# EasyEDA Pro project my_foc.eprj

# Schematic Schematic1
Create Date: 2023-12-03; Page Name: P1; Project Name: my_foc; Schematic Name: Schematic1; Update Date: 2023-12-04; Drawed: LaLin; Page Size: A3; Version: V1.0
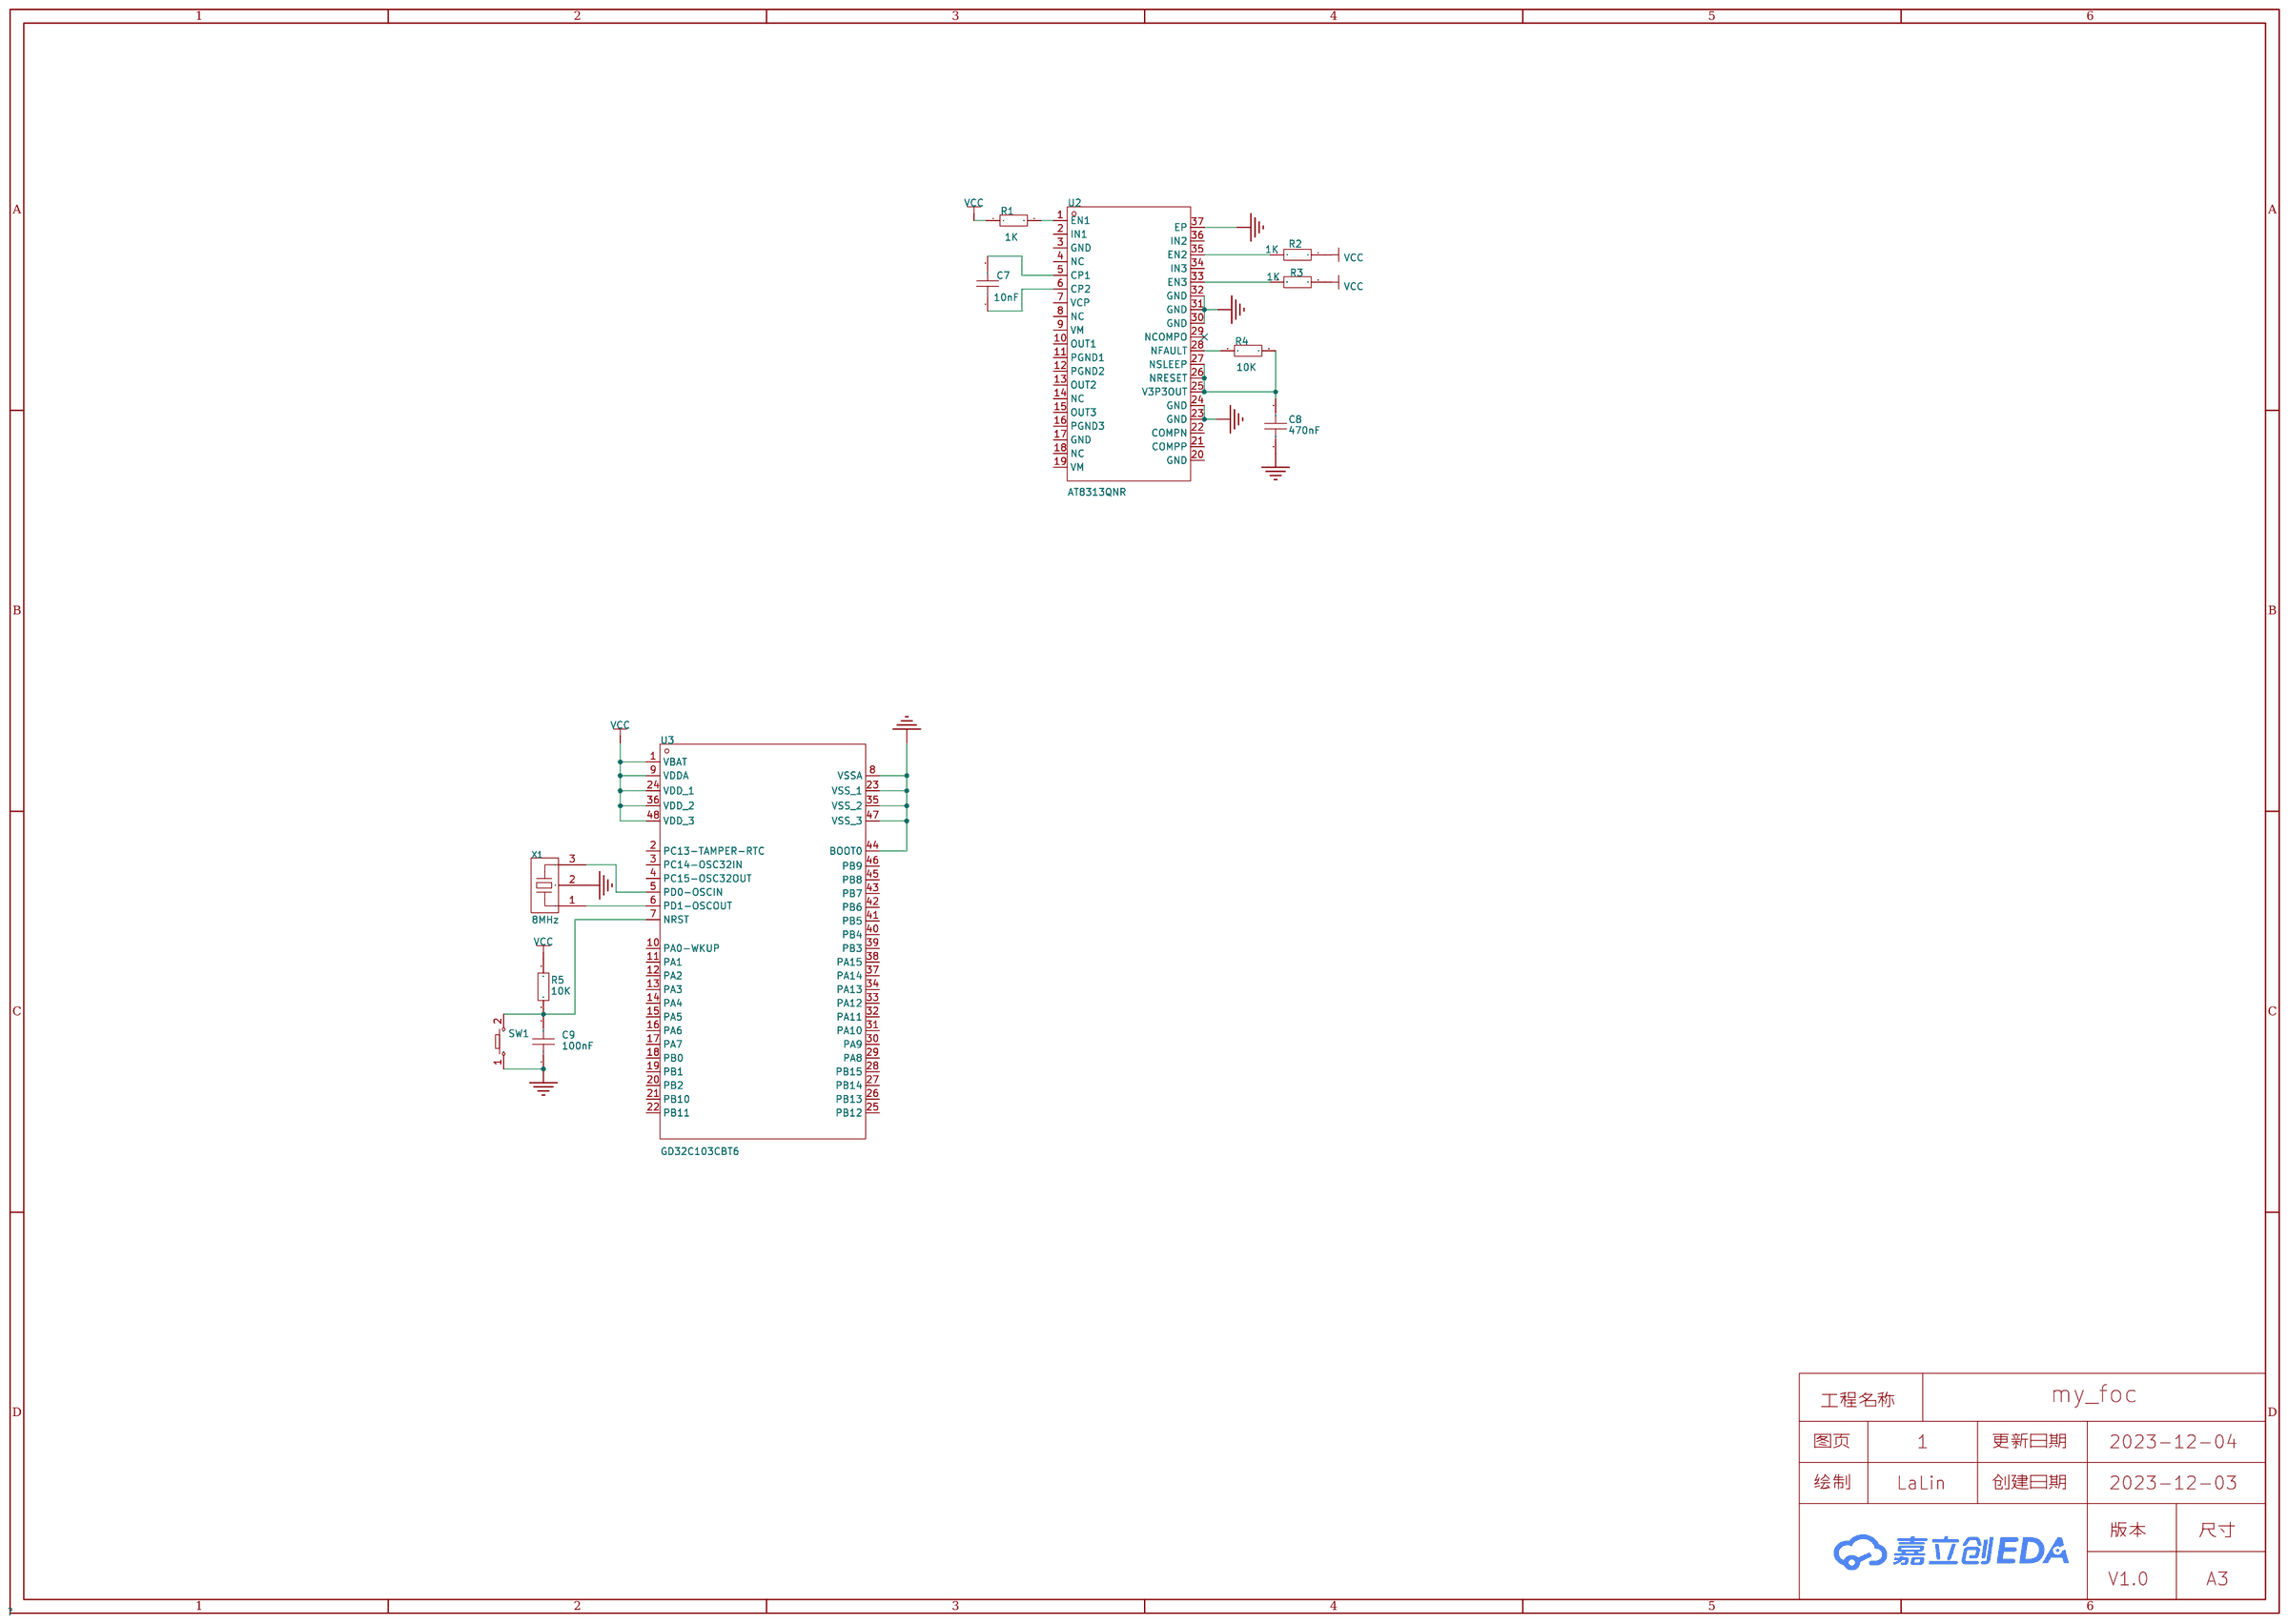
[diagram p0: schematic sheet]

## Parts
C7  10nF  [C0603]
C8  470nF  [C0603]
C9  100nF  [C0603]
R1  1K  [R0603]
R2  1K  [R0603]
R3  1K  [R0603]
R4  10K  [R0603]
R5  10K  [R0603]
SW1  -  [Key_SMD_3x4x2]
U2  AT8313QNR  [QFN-36_L6.0-W6.0-P0.50-TL-EP4.1]
U3  GD32C103CBT6  [LQFP-48_L7.0-W7.0-P0.50-LS9.0-BL]
X1  8MHz  [OSC-SMD_3P-L3.2-W1.3-P1.2-L]

## Library data of the parts
C7-C9 = CAP_0603: Supplier Footprint: 0603
R1-R5 = Res_0603: Supplier Footprint: 0603
SW1 = Key_SMD_3x4x2: Supplier Footprint: SMD
U2 = AT8313QNR: Supplier Part: C5296869; Manufacturer: 杭州中科微; Supplier Footprint: QFN-36; JLCPCB Part Class: 扩展库; Datasheet: https://atta.szlcsc.com/upload/public/pdf/source/20221201/3C14148FDFCD8998E6B5A1E4B6857CE3.pdf; Supplier: LCSC
U3 = GD32C103CBT6: CPU内核:ARM Cortex-M4;CPU最大主频:120MHz;程序存储容量:128KB;程序存储器类型:FLASH;GPIO端口数量:37;工作电压范围:-;RAM总容量:32KB;; LCSC Part Name: GD32C103CBT6 带CAN功能; Supplier Part: C2885643; Manufacturer: GigaDevice(兆易创新); Supplier Footprint: LQFP-48(7x7); JLCPCB Part Class: 扩展库; Datasheet: https://atta.szlcsc.com/upload/public/pdf/source/20210825/C2885643_F7BB04929325AB1735698A5112B59DA1.pdf; Supplier: LCSC; CPU Core: ARM Cortex-M4; CPU Maximum Speed: 120MHz; Program Storage Size: 128KB; Program Memory Type: FLASH; GPIO Ports Number: 37; RAM Size: 32KB; ADC (Bit): 12bit; DAC (Bit): 12bit; 16Bit Timer: 13; CAN: 2; UART/USART: 3; I2C: 2; I2S: 2; SPI: 3; Universal Serial Bus: 有; Peripheral/Function: 看门狗；RTC实时时钟; Watchdog: 有; Real-Time Clock: 有; Internal Oscillator: 有
X1 = CSTCE8M00G52-R0: 频率:8MHz;频率容差:±0.5%;内置负载电容:10pF;谐振阻抗:40Ω;; LCSC Part Name: 8MHz ±0.5% 内置负载电容:10pF; Supplier Part: C22549; Manufacturer: muRata(村田); Supplier Footprint: SMD3213-3P; JLCPCB Part Class: Extended Part; Datasheet: https://atta.szlcsc.com/upload/public/pdf/source/20160120/1457707754326.pdf; Supplier: LCSC; Frequency Tolerance: ±0.5%; Built-in Load Capacitance: 10pF; Resonant Impedance: 40Ω; Operating Temperature: -20℃~+80℃

## Nets
GND: C8.1 C9.1 SW1.1 U2.23(GND) U2.24(GND) U2.30(GND) U2.31(GND) U2.32(GND) U2.37(EP) U3.8(VSSA) U3.23(VSS_1) U3.35(VSS_2) U3.44(BOOT0) U3.47(VSS_3) X1.2
VCC: R1.1 R2.1 R3.1 R5.2 U3.1(VBAT) U3.9(VDDA) U3.24(VDD_1) U3.36(VDD_2) U3.48(VDD_3)
Net-(C7-1): C7.1 U2.6(CP2)
Net-(C7-2): C7.2 U2.5(CP1)
Net-(C8-2): C8.2 R4.2 U2.25(V3P3OUT) U2.26(NRESET) U2.27(NSLEEP)
Net-(C9-2): C9.2 R5.1 SW1.2 U3.7(NRST)
Net-(R1-2): R1.2 U2.1(EN1)
Net-(R2-2): R2.2 U2.35(EN2)
Net-(R3-2): R3.2 U2.33(EN3)
Net-(R4-1): R4.1 U2.28(NFAULT)
Net-(U3-5): U3.5(PD0-OSCIN) X1.3
Net-(U3-6): U3.6(PD1-OSCOUT) X1.1

Not connected (* = marked no-connect by the designer): U2 2(IN1) 3(GND) 4(NC) 7(VCP) 8(NC) 9(VM) 10(OUT1) 11(PGND1) 12(PGND2) 13(OUT2) 14(NC) 15(OUT3) 16(PGND3) 17(GND) 18(NC) 19(VM) 20(GND) 21(COMPP) 22(COMPN) 29(NCOMPO)* 34(IN3) 36(IN2); U3 2(PC13-TAMPER-RTC) 3(PC14-OSC32IN) 4(PC15-OSC32OUT) 10(PA0-WKUP) 11(PA1) 12(PA2) 13(PA3) 14(PA4) 15(PA5) 16(PA6) 17(PA7) 18(PB0) 19(PB1) 20(PB2) 21(PB10) 22(PB11) 25(PB12) 26(PB13) 27(PB14) 28(PB15) 29(PA8) 30(PA9) 31(PA10) 32(PA11) 33(PA12) 34(PA13) 37(PA14) 38(PA15) 39(PB3) 40(PB4) 41(PB5) 42(PB6) 43(PB7) 45(PB8) 46(PB9)
